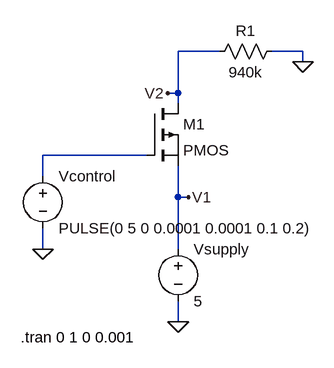
[diagram p0: schematic Switch 1 schematic.asc]
Switch 1 schematic.asc, the LTspice schematic file:
Version 4
SHEET 1 880 680
WIRE 240 -48 176 -48
WIRE 368 -48 320 -48
WIRE 368 -32 368 -48
WIRE 176 16 176 -48
WIRE 176 16 160 16
WIRE 176 32 176 16
WIRE 128 112 -32 112
WIRE -32 144 -32 112
WIRE 176 176 176 128
WIRE 192 176 176 176
WIRE -32 256 -32 224
WIRE 176 256 176 176
WIRE 176 368 176 336
FLAG 368 -32 0
FLAG -32 256 0
FLAG 176 368 0
FLAG 160 16 V2
FLAG 192 176 V1
SYMBOL voltage -32 128 R0
WINDOW 123 0 0 Left 0
WINDOW 39 0 0 Left 0
SYMATTR InstName Vcontrol
SYMATTR Value PULSE(0 5 0 0.0001 0.0001 0.1 0.2)
SYMBOL pmos 128 32 R0
SYMATTR InstName M1
SYMBOL voltage 176 240 R0
WINDOW 123 0 0 Left 0
WINDOW 39 0 0 Left 0
SYMATTR InstName Vsupply
SYMATTR Value 5
SYMBOL res 336 -64 R90
WINDOW 0 0 56 VBottom 2
WINDOW 3 32 56 VTop 2
SYMATTR InstName R1
SYMATTR Value 940k
TEXT -66 392 Left 2 !.tran 0 1 0 0.001

The netlist it stands for:
* Switch 1 schematic.asc
Vcontrol N001 0 PULSE(0 5 0 0.0001 0.0001 0.1 0.2)
M1 V2 N001 V1 V1 PMOS
Vsupply V1 0 5
R1 0 V2 940k
.model NMOS NMOS
.model PMOS PMOS
.lib standard.mos
.tran 0 1 0 0.001
.backanno
.end